# Altium schematic sheet 05-TYPEC_MUX_USB2.SchDoc: USB Type-C socket, USB multiplexing
size A3; DrawnBy: Rain Adelbert; Revision: 1.2; SheetNumber: 5; SheetTotal: 9
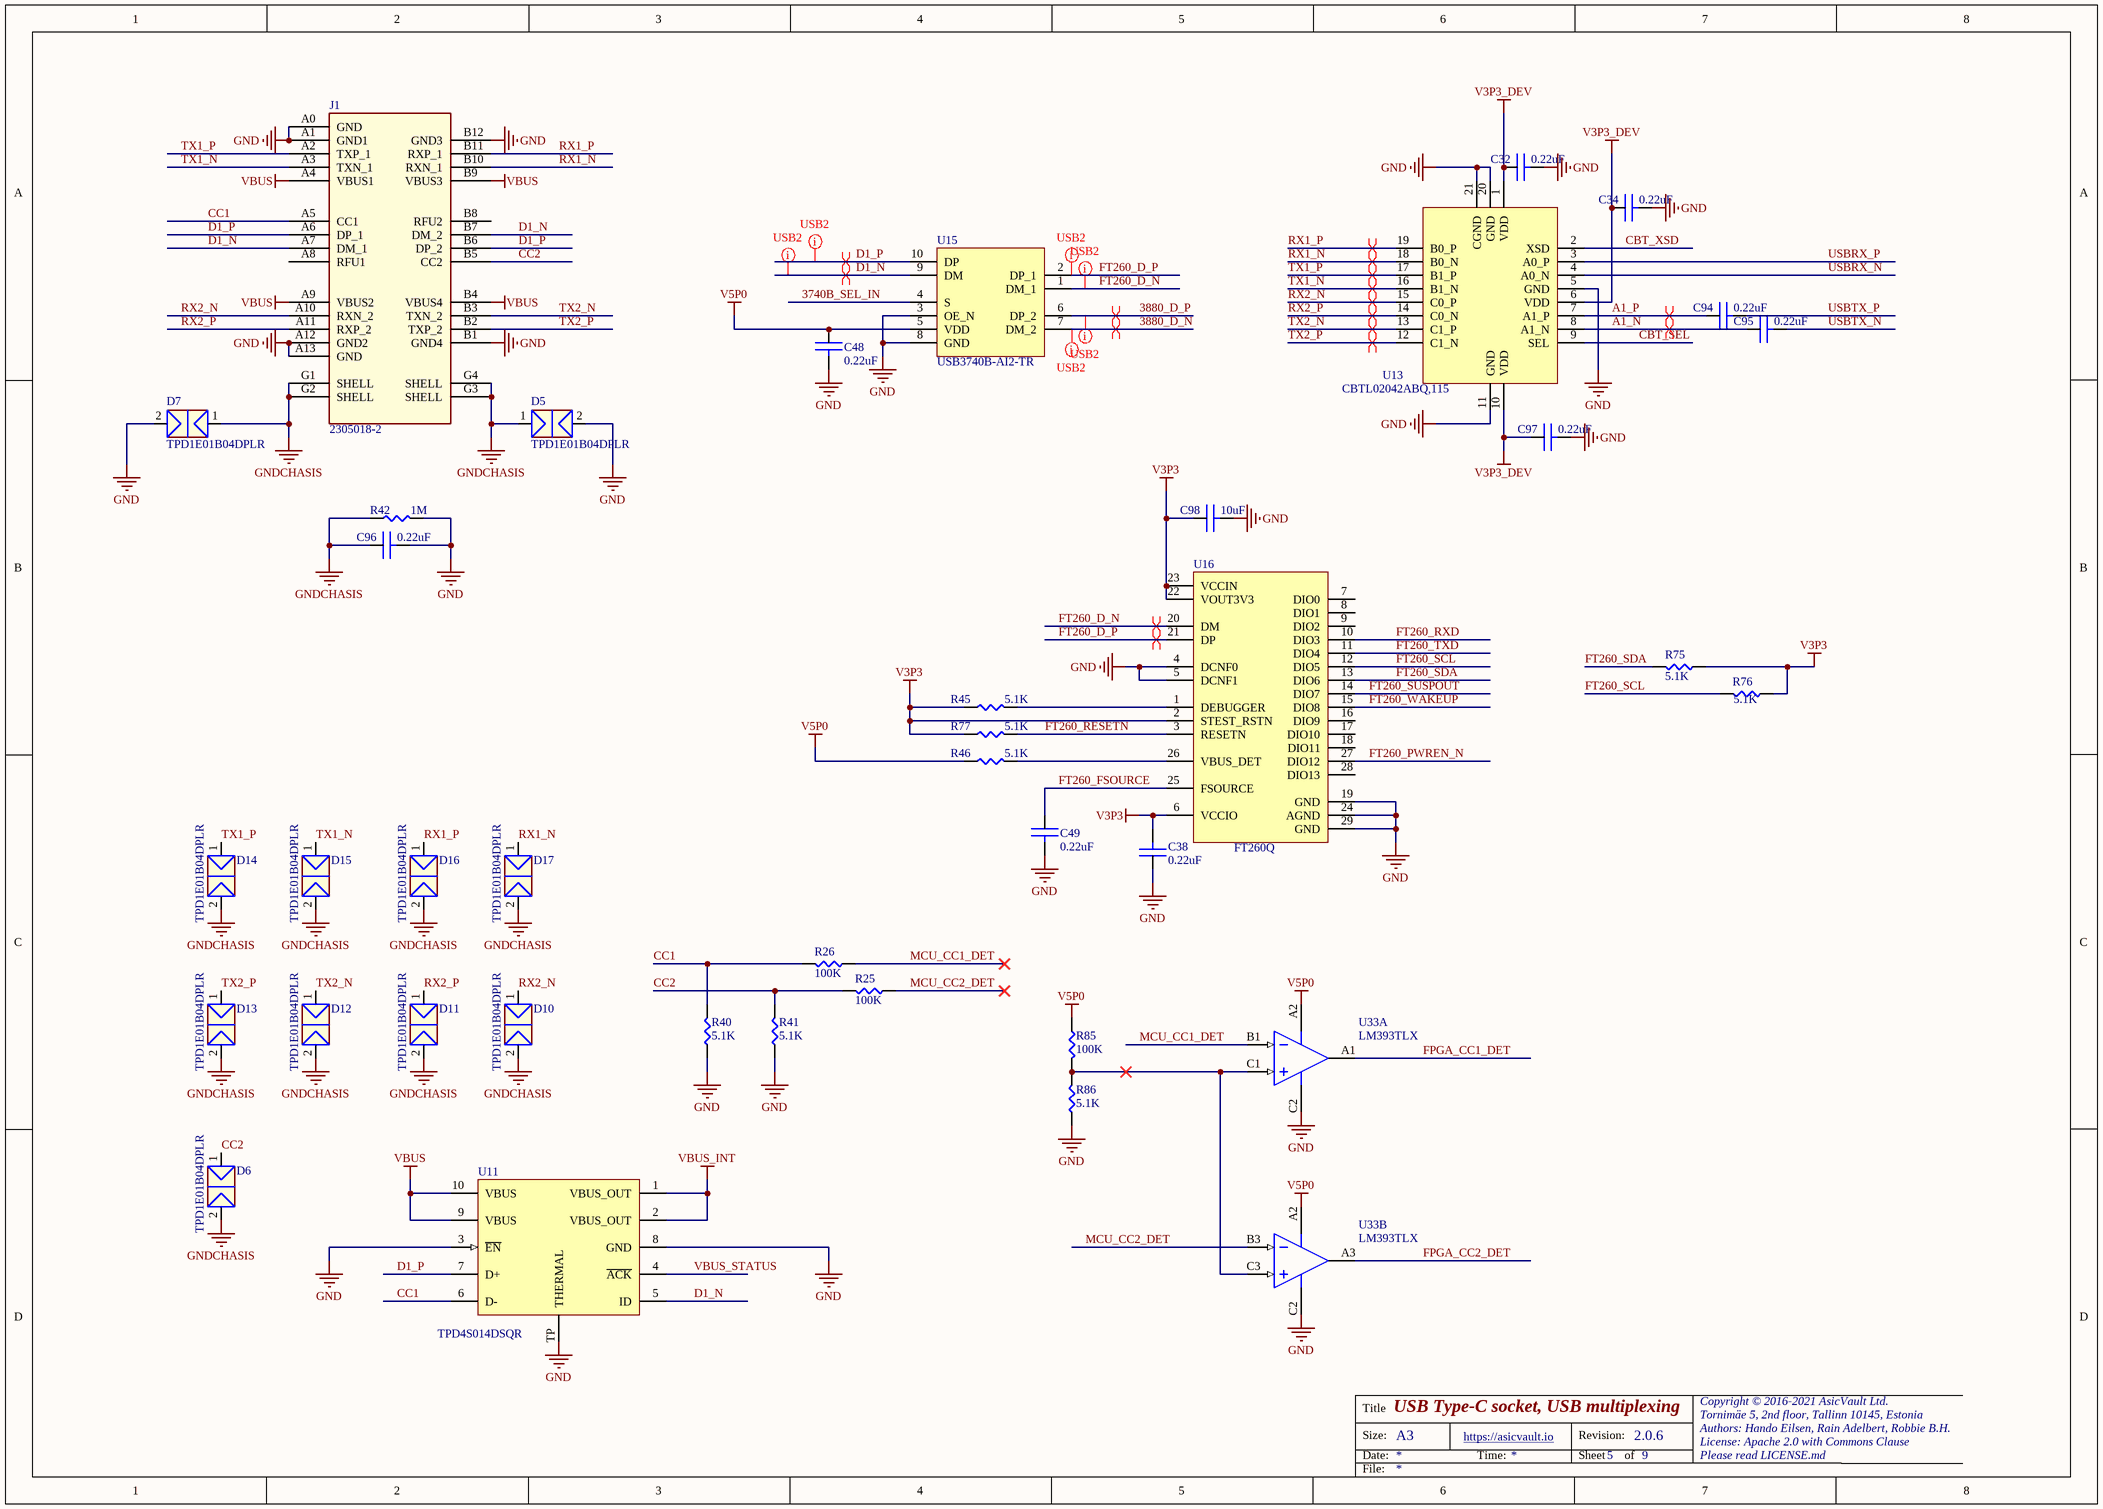
[diagram p0: 05-TYPEC_MUX_USB2.SchDoc]

## Parts
C32  0.22uF  [C0201]
C34  0.22uF  [C0201]
C38  0.22uF  [C0201]
C48  0.22uF  [C0201]
C49  0.22uF  [C0201]
C94  0.22uF  [C0201]
C95  0.22uF  [C0201]
C96  0.22uF  [C0201]
C97  0.22uF  [C0201]
C98  10uF  [C0402]
D5  TPD1E01B04DPLR  [X2XON2]
D6  TPD1E01B04DPLR  [X2XON2]
D7  TPD1E01B04DPLR  [X2XON2]
D10  TPD1E01B04DPLR  [X2XON2]
D11  TPD1E01B04DPLR  [X2XON2]
D12  TPD1E01B04DPLR  [X2XON2]
D13  TPD1E01B04DPLR  [X2XON2]
D14  TPD1E01B04DPLR  [X2XON2]
D15  TPD1E01B04DPLR  [X2XON2]
D16  TPD1E01B04DPLR  [X2XON2]
D17  TPD1E01B04DPLR  [X2XON2]
J1  2305018-2  [2305018-2]
R25  100K  [R0201]
R26  100K  [R0201]
R40  5.1K  [R0201]
R41  5.1K  [R0201]
R42  1M  [R0402]
R45  5.1K  [R0201]
R46  5.1K  [R0201]
R75  5.1K  [R0201]
R76  5.1K  [R0201]
R77  5.1K  [R0201]
R85  100K  [R0201]
R86  5.1K  [R0201]
U11  TPD4S014DSQR  [R-PWSON-N10]
U13  CBTL02042ABQ,115  [DHVQFN20P]
U15  USB3740B-AI2-TR  [QFN10_1318]
U16  FT260Q  [WQFN28]
U33  LM393TLX  [DSBGA8x3]  (parts A,B of 2)

## Nets
GND: C32.2 C34.2 C38.1 C48.2 C49.2 C96.2 C97.2 C98.2 D5.2(K) D7.2(K) J1.A0(GND) J1.A1(GND1) J1.A12(GND2) J1.A13(GND) J1.B1(GND4) J1.B12(GND3) R40.1 R41.1 R42.2 R86.1 U11.3(~{EN}) U11.8(GND) U11.TP(THERMAL) U13.5(GND) U13.11(GND) U13.20(GND) U13.21(CGND) U15.3(OE_N) U15.8(GND) U16.4(DCNF0) U16.5(DCNF1) U16.19(GND) U16.24(AGND) U16.29(GND) U33.C2(GND)
GNDCHASIS: C96.1 D5.1(A) D6.2(K) D7.1(A) D10.2(K) D11.2(K) D12.2(K) D13.2(K) D14.2(K) D15.2(K) D16.2(K) D17.2(K) J1.G1(SHELL) J1.G2(SHELL) J1.G3(SHELL) J1.G4(SHELL) R42.1
V3P3: C38.2 C98.1 R45.1 R75.2 R76.2 R77.1 U16.2(STEST_RSTN) U16.6(VCCIO) U16.22(VOUT3V3) U16.23(VCCIN)
V3P3_DEV: C32.1 C34.1 C97.1 U13.1(VDD) U13.6(VDD) U13.10(VDD)
V5P0: C48.1 R46.1 R85.1 U15.5(VDD) U33.A2(V+)
VBUS: J1.A4(VBUS1) J1.A9(VBUS2) J1.B4(VBUS4) J1.B9(VBUS3) U11.9(VBUS) U11.10(VBUS)
VBUS_INT: U11.1(VBUS_OUT) U11.2(VBUS_OUT)
3740B_SEL_IN: U15.4(S)
3880_D_N: U15.7(DM_2)
3880_D_P: U15.6(DP_2)
A1_N: C95.1 U13.8(A1_N)
A1_P: C94.1 U13.7(A1_P)
CBT_SEL: U13.9(SEL)
CBT_XSD: U13.2(XSD)
CC1: J1.A5(CC1) R26.2 R40.2 U11.6(D-)
CC2: D6.1(A) J1.B5(CC2) R25.2 R41.2
D1_N: J1.A7(DM_1) J1.B7(DM_2) U11.5(ID) U15.9(DM)
D1_P: J1.A6(DP_1) J1.B6(DP_2) U11.7(D+) U15.10(DP)
FPGA_CC1_DET: U33.A1(OUT)
FPGA_CC2_DET: U33.A3(OUT)
FT260_D_N: U15.1(DM_1) U16.20(DM)
FT260_D_P: U15.2(DP_1) U16.21(DP)
FT260_FSOURCE: C49.1 U16.25(FSOURCE)
FT260_PWREN_N: U16.27(DIO12)
FT260_RESETN: R77.2 U16.3(RESETN)
FT260_RXD: U16.10(DIO3)
FT260_SCL: R76.1 U16.12(DIO5)
FT260_SDA: R75.1 U16.13(DIO6)
FT260_SUSPOUT: U16.14(DIO7)
FT260_TXD: U16.11(DIO4)
FT260_WAKEUP: U16.15(DIO8)
MCU_CC1_DET: R26.1 U33.B1(IN-)
MCU_CC2_DET: R25.1 U33.B3(IN-)
RX1_N: D17.1(A) J1.B10(RXN_1) U13.18(B0_N)
RX1_P: D16.1(A) J1.B11(RXP_1) U13.19(B0_P)
RX2_N: D10.1(A) J1.A10(RXN_2) U13.15(C0_P)
RX2_P: D11.1(A) J1.A11(RXP_2) U13.14(C0_N)
TX1_N: D15.1(A) J1.A3(TXN_1) U13.16(B1_N)
TX1_P: D14.1(A) J1.A2(TXP_1) U13.17(B1_P)
TX2_N: D12.1(A) J1.B3(TXN_2) U13.13(C1_P)
TX2_P: D13.1(A) J1.B2(TXP_2) U13.12(C1_N)
USBRX_N: U13.4(A0_N)
USBRX_P: U13.3(A0_P)
USBTX_N: C95.2
USBTX_P: C94.2
VBUS_STATUS: U11.4(~{ACK})
NetR45_2: R45.2 U16.1(DEBUGGER)
NetR46_2: R46.2 U16.26(VBUS_DET)
NetR85_2: R85.2 R86.2 U33.C1(IN+) U33.C3(IN+)

Not connected (* = marked no-connect by the designer): J1 A8(RFU1) B8(RFU2); U16 7(DIO0) 8(DIO1) 9(DIO2) 16(DIO9) 17(DIO10) 18(DIO11) 28(DIO13)

## Layout directives
differential pair: 3880_D_N, 3880_D_P, A1_N, A1_P, D1_N, D1_P, FT260_D_N, FT260_D_P, RX1_N, RX1_P, RX2_N, RX2_P, TX1_N, TX1_P, TX2_N, TX2_P
net class USB2: 3880_D_N, 3880_D_P, D1_N, D1_P, FT260_D_N, FT260_D_P

## Notes on the sheet
- Title
- Size:
- Date:
- A3
- https://asicvault.io
- Time:
- Revision:
- Sheet
- of
- 2.0.6
- Copyright © 2016-2021 AsicVault Ltd.
- Tornimäe 5, 2nd floor, Tallinn 10145, Estonia
- Authors: Hando Eilsen, Rain Adelbert, Robbie B.H.
- License: Apache 2.0 with Commons Clause
- Please read LICENSE.md
- File:

## Library data of the parts
C32 C34 C38 C48 C49 C94-C97 = 0.22uF/0201: Description 1: CAP CER 0.22UF 6.3V X7S 0201; Supplier Part Number 1: 445-9075-1-ND; Supplier 1: Digi-Key
C98 = 10uF/0402: Description 1: Multilayer Ceramic Capacitors MLCC - SMD/SMT 10uF 20% 6.3 Volts 0402; Supplier Part Number 1: 791-0402X106M6R3CT; Supplier 1: Mouser
D5-D7 D10-D17 = TPD1E01B04DPLR: Description 1: TVS DIODE 3.6VWM 15VC 2X2SON; Supplier 1: Digi-Key; Supplier Part Number 1: TPD1E01B04DPLR-ND
J1 = 2305018-2: USB TYPE C, REC IPX8 ON BOARD DUAL SMT; Supplier 1: Mouser; Supplier Part Number 1: 571-2305018-2; Description 1: USB TYPE C, REC IPX8 ON BOARD DUAL SMT
R25 R26 R85 = 100K/1%/0201: Description 1: RES SMD 100K OHM 1% 1/20W 0201; Supplier 1: Digi-Key; Supplier Part Number 1: 311-100KMCT-ND
R40 R41 R45 R46 R75-R77 R86 = 5.1K/1%/0201: Description 1: RES SMD 5.1K OHM 1% 1/20W 0201; Supplier 1: Digi-Key; Supplier Part Number 1: YAG2741CT-ND
R42 = 1M/1%/0402: Description 1: RES SMD 1M OHM 1% 1/16W 0402; Supplier 1: Digi-Key; Supplier Part Number 1: 311-1.00MLRCT-ND
U11 = TPD4S014DSQR: Haptic Drive for ERM and LRA; Description 1: TPD4S014 USB Charger Port Protection; Supplier 1: Mouser; Supplier Part Number 1: 595-TPD4S014DSQR
U13 = CBTL02042ABQ,115: Description 1: IC MUX/DEMUX 2:1 PCI 20DHVQFN; Supplier 1: Digi-Key; Supplier Part Number 1: 568-6676-1-ND
U15 = USB3740B-AI2-TR: Description 1: IC CONTROLLER USB 10QFN; Supplier 1: Digi-Key; Supplier Part Number 1: USB3740B-AI2-TR-ND
U16 = FT260Q: Description 1: HID-CLASS USB TO UART/I2C BRIDGE; Supplier 1: Digi-Key; Supplier Part Number 1: 768-1268-ND
U33 = LM393TLX: Dual Voltage Comparator; Description 1: Low Power Low Offset Voltage Dual Comparator 8-DSBGA 0 to 70; Supplier 1: Mouser; Supplier Part Number 1: 926-LM393TLX/NOPB